# Altium schematic sheet Digital.SchDoc: Digital
size A3; DocumentNumber: 9; Revision: 0v1; SheetNumber: 9; SheetTotal: 10
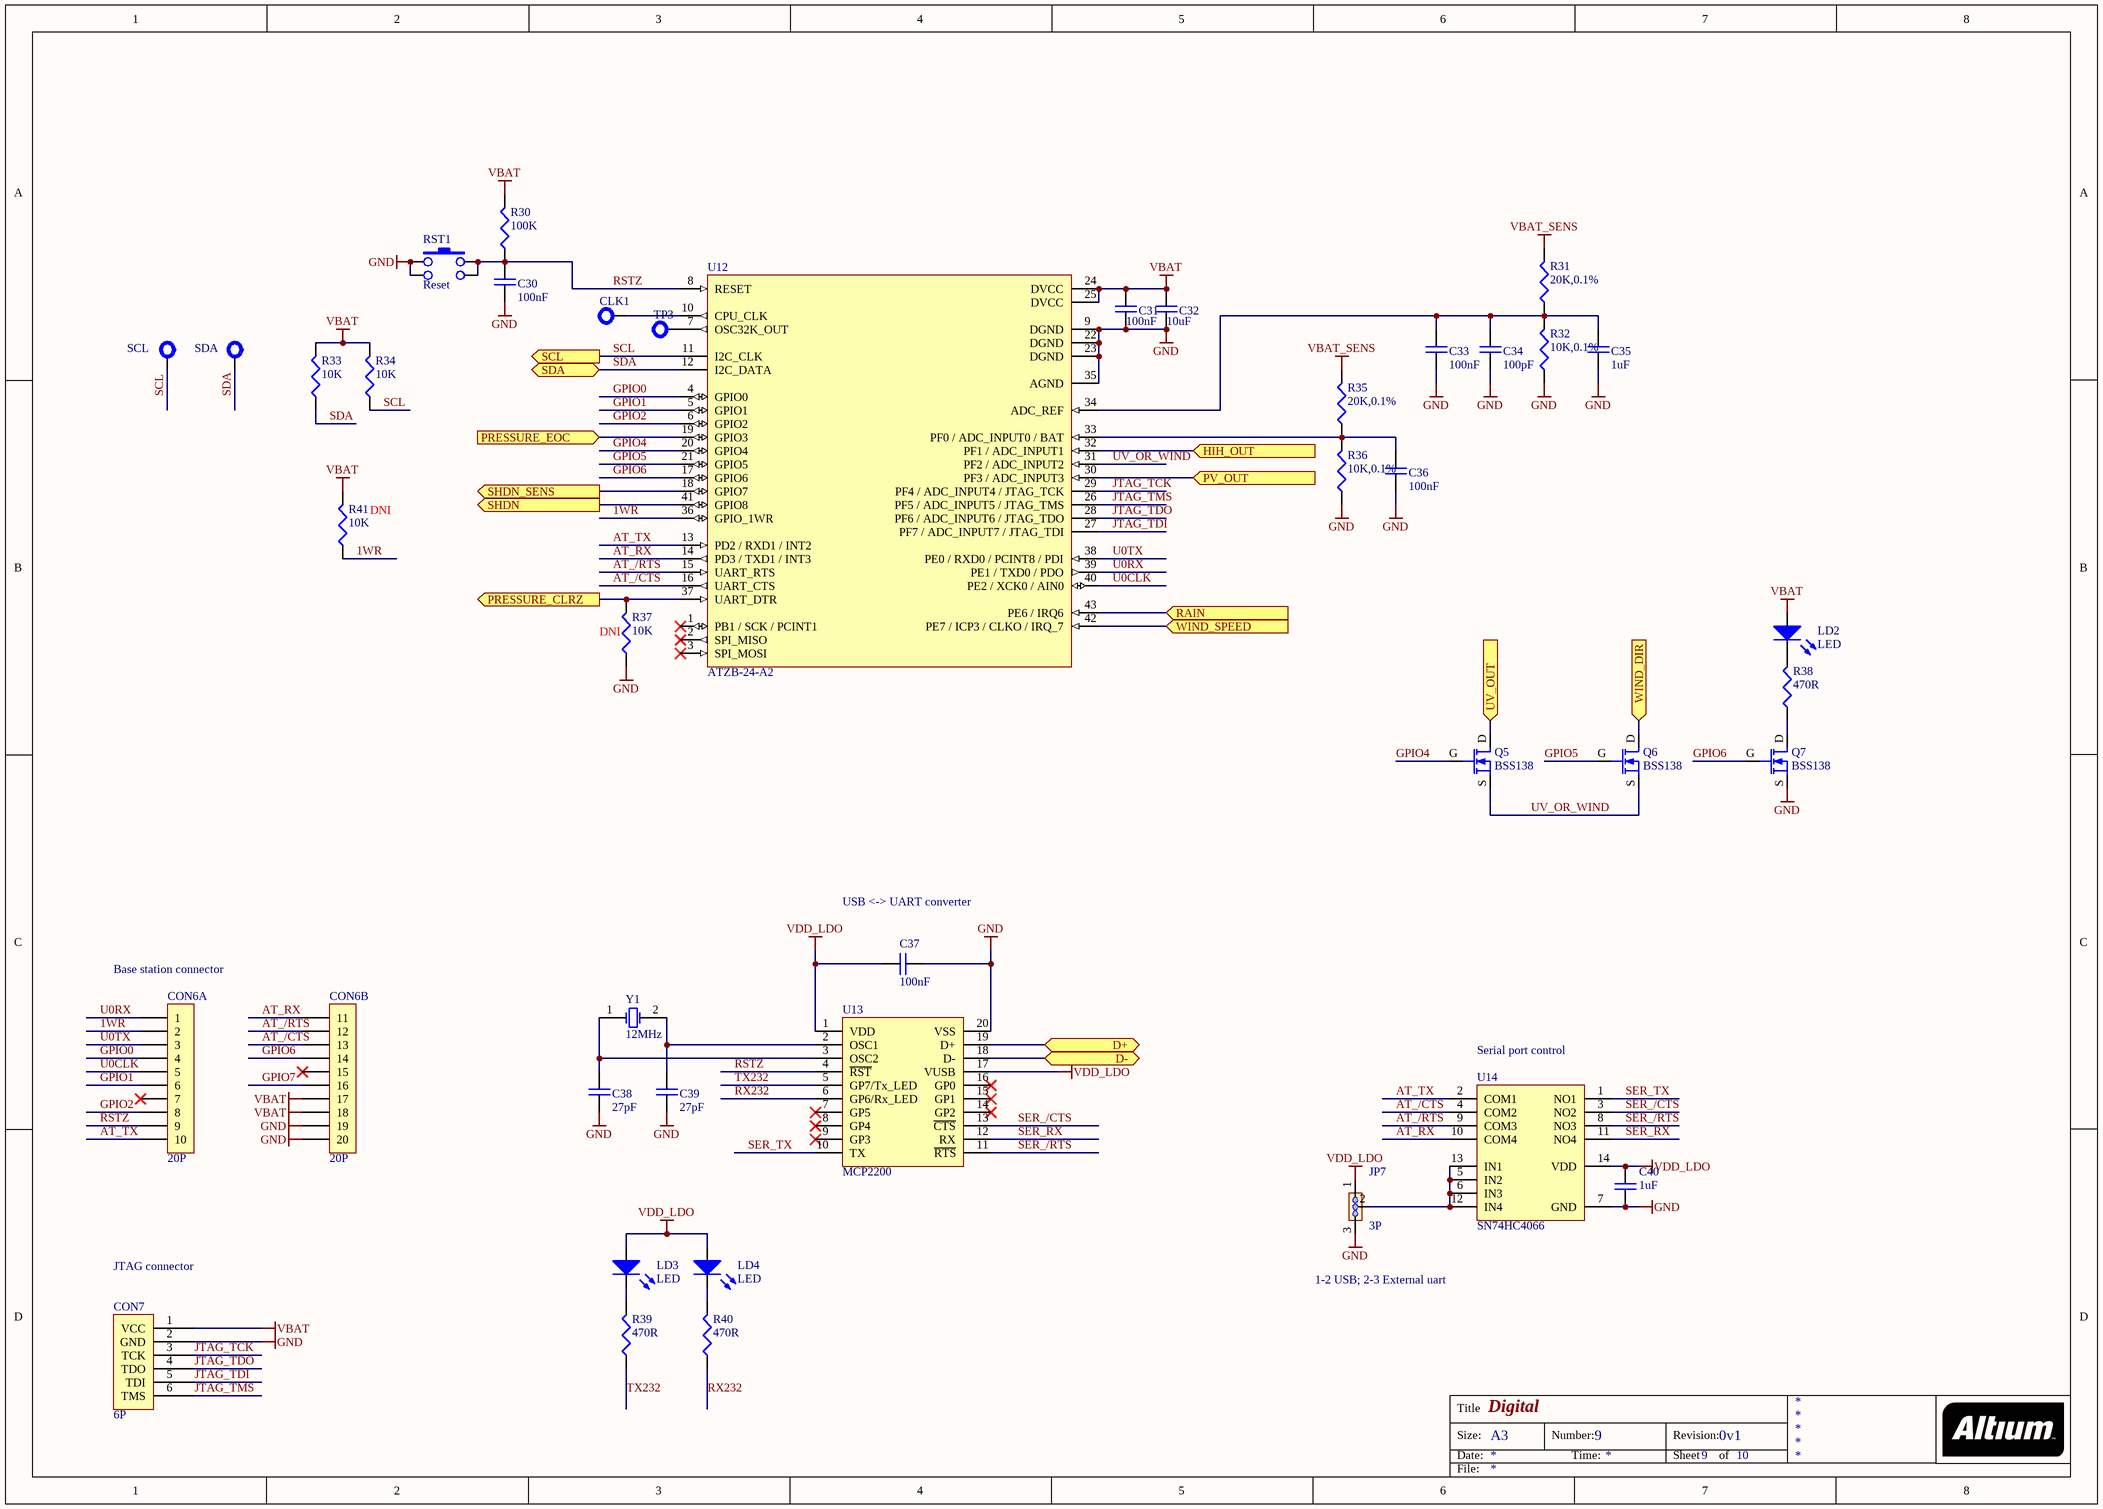
[diagram p0: Digital.SchDoc]

## Parts
C30  100nF  [0603]
C31  100nF  [0603]
C32  10uF  [0805]
C33  100nF  [0603]
C34  100pF  [0603]
C35  1uF  [0603]
C36  100nF  [0603]
C37  100nF  [0603]
C38  27pF  [0603]
C39  27pF  [0603]
C40  1uF  [0603]
CLK1  Test Point  [TERMINAL]  (value not drawn)  (no BOM)
CON6  20P  [IDC-20]  (parts A,B of 2)
CON7  6P  [SIP-6-JTAG]
JP7  3P  [SIP-3]
LD2  LED  [0805@DIODE]
LD3  LED  [0805@DIODE]
LD4  LED  [0805@DIODE]
Q5  BSS138  [SOT-23@GSD]
Q6  BSS138  [SOT-23@GSD]
Q7  BSS138  [SOT-23@GSD]
R30  100K  [0603]
R31  20K,0.1%  [0603]
R32  10K,0.1%  [0603]
R33  10K  [0603]
R34  10K  [0603]
R35  20K,0.1%  [0603]
R36  10K,0.1%  [0603]
R37  10K  [0603]
R38  470R  [0603]
R39  470R  [0603]
R40  470R  [0603]
R41  10K  [0603]
RST1  Reset  [MICROSWITCH]
SCL  Test Point  [TERMINAL]  (value not drawn)  (no BOM)
SDA  Test Point  [TERMINAL]  (value not drawn)  (no BOM)
TP3  Test Point  [TERMINAL]  (value not drawn)  (no BOM)
U12  ATZB-24-A2  [ATZB-24-A2]
U13  MCP2200  [SOIC-20]
U14  SN74HC4066  [TSSOP-14]
Y1  12MHz  [CSM-7]

## Ports
D+, D-, HIH_OUT (in), PRESSURE_CLRZ (out), PRESSURE_EOC (in), PV_OUT (in), RAIN (in), SCL (out), SDA (bidir), SHDN (out), SHDN_SENS (out), UV_OUT (in), WIND_DIR (in), WIND_SPEED (in)

## Nets
GND: C30.1 C31.1 C32.1 C33.1 C34.1 C35.1 C36.1 C37.1 C38.1 C39.1 C40.1 CON6.19 CON6.20 CON7.2(GND) JP7.3 Q7.S R32.1 R36.1 R37.1 RST1.1 RST1.3 U12.9(DGND) U12.22(DGND) U12.23(DGND) U12.35(AGND) U13.20(VSS) U14.7(GND)
VBAT: C31.2 C32.2 CON6.17 CON6.18 CON7.1(VCC) LD2.A R30.2 R33.2 R34.2 R41.2 U12.24(DVCC) U12.25(DVCC)
VBAT_SENS: R31.2 R35.2
VDD_LDO: C37.2 C40.2 JP7.1 LD3.A LD4.A U13.1(VDD) U13.17(VUSB) U14.14(VDD)
1WR: CON6.2 R41.1 U12.36(GPIO_1WR)
AT_/CTS: CON6.13 U12.16(UART_CTS) U14.4(COM2)
AT_/RTS: CON6.12 U12.15(UART_RTS) U14.9(COM3)
AT_RX: CON6.11 U12.14(PD3_/_TXD1_/_INT3) U14.10(COM4)
AT_TX: CON6.10 U12.13(PD2_/_RXD1_/_INT2) U14.2(COM1)
D+: U13.19(D+) ; port D+
D-: U13.18(D-) ; port D-
GPIO0: CON6.4 U12.4(GPIO0)
GPIO1: CON6.6 U12.5(GPIO1)
GPIO2: CON6.8 U12.6(GPIO2)
GPIO4: Q5.G U12.20(GPIO4)
GPIO5: Q6.G U12.21(GPIO5)
GPIO6: CON6.14 Q7.G U12.17(GPIO6)
GPIO7: CON6.16
HIH_OUT: U12.32(PF1_/_ADC_INPUT1) ; port HIH_OUT
JTAG_TCK: CON7.3(TCK) U12.29(PF4_/_ADC_INPUT4_/_JTAG_TCK)
JTAG_TDI: CON7.5(TDI) U12.27(PF7_/_ADC_INPUT7_/_JTAG_TDI)
JTAG_TDO: CON7.4(TDO) U12.28(PF6_/_ADC_INPUT6_/_JTAG_TDO)
JTAG_TMS: CON7.6(TMS) U12.26(PF5_/_ADC_INPUT5_/_JTAG_TMS)
PRESSURE_CLRZ: R37.2 U12.37(UART_DTR) ; port PRESSURE_CLRZ
PRESSURE_EOC: U12.19(GPIO3) ; port PRESSURE_EOC
PV_OUT: U12.30(PF3_/_ADC_INPUT3) ; port PV_OUT
RAIN: U12.43(PE6_/_IRQ6) ; port RAIN
RSTZ: C30.2 CON6.9 R30.1 RST1.2 RST1.4 U12.8(RESET) U13.4(~{RST})
RX232: R40.1 U13.6(GP6/Rx_LED)
SCL: R34.1 SCL.1(TP) U12.11(I2C_CLK) ; port SCL
SDA: R33.1 SDA.1(TP) U12.12(I2C_DATA) ; port SDA
SER_/CTS: U13.13(~{CTS}) U14.3(NO2)
SER_/RTS: U13.11(~{RTS}) U14.8(NO3)
SER_RX: U13.12(RX) U14.11(NO4)
SER_TX: U13.10(TX) U14.1(NO1)
SHDN: U12.41(GPIO8) ; port SHDN
SHDN_SENS: U12.18(GPIO7) ; port SHDN_SENS
TX232: R39.1 U13.5(GP7/Tx_LED)
U0CLK: CON6.5 U12.40(PE2_/_XCK0_/_AIN0)
U0RX: CON6.1 U12.39(PE1_/_TXD0_/_PDO)
U0TX: CON6.3 U12.38(PE0_/_RXD0_/_PCINT8_/_PDI)
UV_OR_WIND: Q5.S Q6.S U12.31(PF2_/_ADC_INPUT2)
UV_OUT: Q5.D ; port UV_OUT
WIND_DIR: Q6.D ; port WIND_DIR
WIND_SPEED: U12.42(PE7_/_ICP3_/_CLKO_/_IRQ_7) ; port WIND_SPEED
NetC33_2: C33.2 C34.2 C35.2 R31.1 R32.2 U12.34(ADC_REF)
NetC36_2: C36.2 R35.1 R36.2 U12.33(PF0_/_ADC_INPUT0_/_BAT)
NetC38_2: C38.2 U13.3(OSC2) Y1.1(OSC1)
NetC39_2: C39.2 U13.2(OSC1) Y1.2(OSC2)
NetCLK1_1: CLK1.1(TP) U12.10(CPU_CLK)
NetJP7_2: JP7.2 U14.5(IN2) U14.6(IN3) U14.12(IN4) U14.13(IN1)
NetLD2_K: LD2.K R38.2
NetLD3_K: LD3.K R39.2
NetLD4_K: LD4.K R40.2
NetQ7_D: Q7.D R38.1
NetTP3_1: TP3.1(TP) U12.7(OSC32K_OUT)

Not connected (* = marked no-connect by the designer): CON6 7* 15*; U12 1(PB1_/_SCK_/_PCINT1)* 2(SPI_MISO)* 3(SPI_MOSI)*; U13 7(GP5)* 8(GP4)* 9(GP3)* 14(GP2)* 15(GP1)* 16(GP0)*

## Notes on the sheet
- (near R41) DNI
- (near R37) DNI
- USB <-> UART converter
- (near CON6) Base station connector
- (near U14) Serial port control
- JTAG connector
- 1-2 USB; 2-3 External uart
- Title
- Size:
- Date:
- A3
- Number:
- Time:
- Revision:
- Sheet
- of
- File:

## Library data of the parts
C30-C40 = CAP: Capacitor; Owner: Nuno Brum; Sub-Type: Ceramic; Assembly: INS; Maximum Voltage: *; Creation Date: 2005-04-28; Status: Valid; Validation date: 2006-05-15; Type: Capacitor
CLK1 SCL SDA TP3 = TEST-PROBE: Test/Probe Point; Owner: Nuno Brum; Sub-Type: Mechanical; Assembly: PCB; Validation Date: 2006-05-15; Type: PCB; Creation Date: 2005-06-01; Status: Valid
CON6 = CON20: Connector 20 Pins; Owner: Nuno Brum; Assembly: INS; Sub-Type: Connector; Creation Date: 2005-06-01; Status: Valid; Validation Date: 2006-05-15; Type: Electrical & Mechanical
CON7 = CON-JTAG: Generic JTAG Connector; Owner: António Oliveira; Assembly: INS; Sub-Type: Connector; Creation Date: 2005-11-07; Status: Valid; Validation Date: 2006-05-15; Type: Electrical & Mechanical
JP7 = JMP3: 3-Jumper; Owner: Nuno Brum; Sub-Type: Connector; STATE1: 0; Assembly: INS; Validation Date: 2006-05-15; Creation Date: 2002-07-17; Status: Valid; Type: Electrical & Mechanical
LD2-LD4 = LED: Light emitting diode; Owner: Nuno Brum; Assembly: INS; Creation Date: 2001-06-05; Sub-Type: LED; Status: Valid; Validation date: 2006-05-15; Model: LED; Type: Diode
Q5-Q7 = MOSFET-N: N-Channel Logic Level Enhancement Mode Field Effect Transistor; pin to pad: 2>3 3>2; Owner: Nuno Brum; Sub-Type: MOSFET; Assembly: INS; Creation Date: 2001-06-05; Status: Valid; Model: BSS138; Type: Transistor
R30-R41 = RES: Resistor; Owner: Nuno Brum; Sub-Type: Generic; Assembly: INS; Validation date: 2006-05-15; Creation Date: 2002-07-17; Status: Valid; Power: *; Type: Resistor
RST1 = SW1: Switch Push Button; Owner: Nuno Brum; Assembly: INS; Validation Date: 2006-05-15; Sub-Type: Switch; Creation Date: 2002-07-17; Status: Valid; Type: Electrical & Mechanical
U12 = ATZB-24-A2: Zigbee Module; Type: IC; Creation Date: 2012-03-06
U13 = MCP2200: USB to Serial interface; Published: 29-Jan-2009; DatasheetVersion: revE, Aug-2007; PackageVersion: revBB, Aug-2009; PackageReference: SSOP-SS20; Publisher: Altium Limited; PackageDescription: 20-Lead Plastic Shrink Small Outline (SS) - 5.3mm Body [SSOP]; Supplier 1: Digi-Key; Supplier Part Number 1: MCP23008T-E/SS-ND; Code_JEDEC: MO-150; Code_IPC: SOP65P780-20; ComponentLink1Description: Datasheet; ComponentLink1URL: http://ww1.microchip.com/downloads/en/DeviceDoc/21919e.pdf; ComponentLink2Description: Packaging Specification; ComponentLink2URL: http://www.microchip.com/stellent/groups/techpub_sg/documents/packagingspec/en012702.pdf; ComponentLink3Description: Microchip.com Home; ComponentLink3URL: http://www.microchip.com/
U14 = MAX4751: 4 analog switch (normally open)
Y1 = Crystal Oscillator: Published: 17-Jul-2002; DatasheetDocument: 18-Apr-2000; PackageReference: CSM-7; Publisher: Altium Limited; ComponentLink1Description: Manufacturer Link; ComponentLink1URL: http://www.ecsxtal.com/; ComponentLink2Description: Datasheet; ComponentLink2URL: http://www.ecsxtal.com/pdf3/CSM_7.pdf